# EAGLE schematic Midi-zu-Usb (EAGLE 6.0)
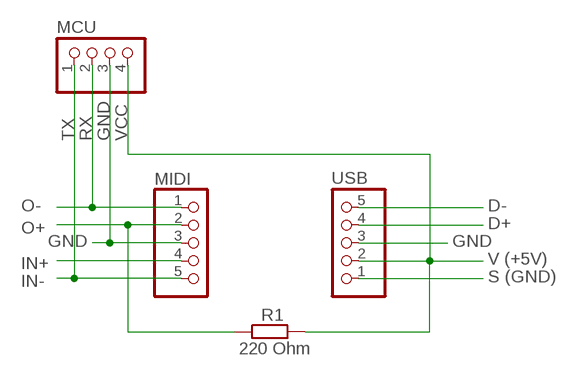
[diagram p0: schematic, sheet 1]

## Parts
MCU  PINHD-1X4  [1X04]
MIDI  PINHD-1X5  [1X05]
R1  220 Ohm  R-EU_0204/7  [0204/7]
USB  PINHD-1X5  [1X05]

## Nets
N$1: USB.5
N$2: USB.1
N$3: MCU.4 R1.2 USB.2
N$4: USB.4
N$5: USB.3
N$6: MCU.2 MIDI.1
N$7: MCU.1 MIDI.5
N$8: MIDI.4
N$9: MIDI.2 R1.1
N$10: MCU.3 MIDI.3

## Notes on the sheet
- TX | RX | GND | VCC
- O- | D-
- O+ | D+
- GND | GND
- IN+ | V (+5V)
- IN- | S (GND)

## Library data of the parts
MCU = pinhead:PINHD-1X4: PIN HEADER
MIDI USB = pinhead:PINHD-1X5: PIN HEADER
R1 = rcl:R-EU_: RESISTOR, European symbol